# Altium schematic sheet sheet reciver.schdoc
size 278 x 209 mm
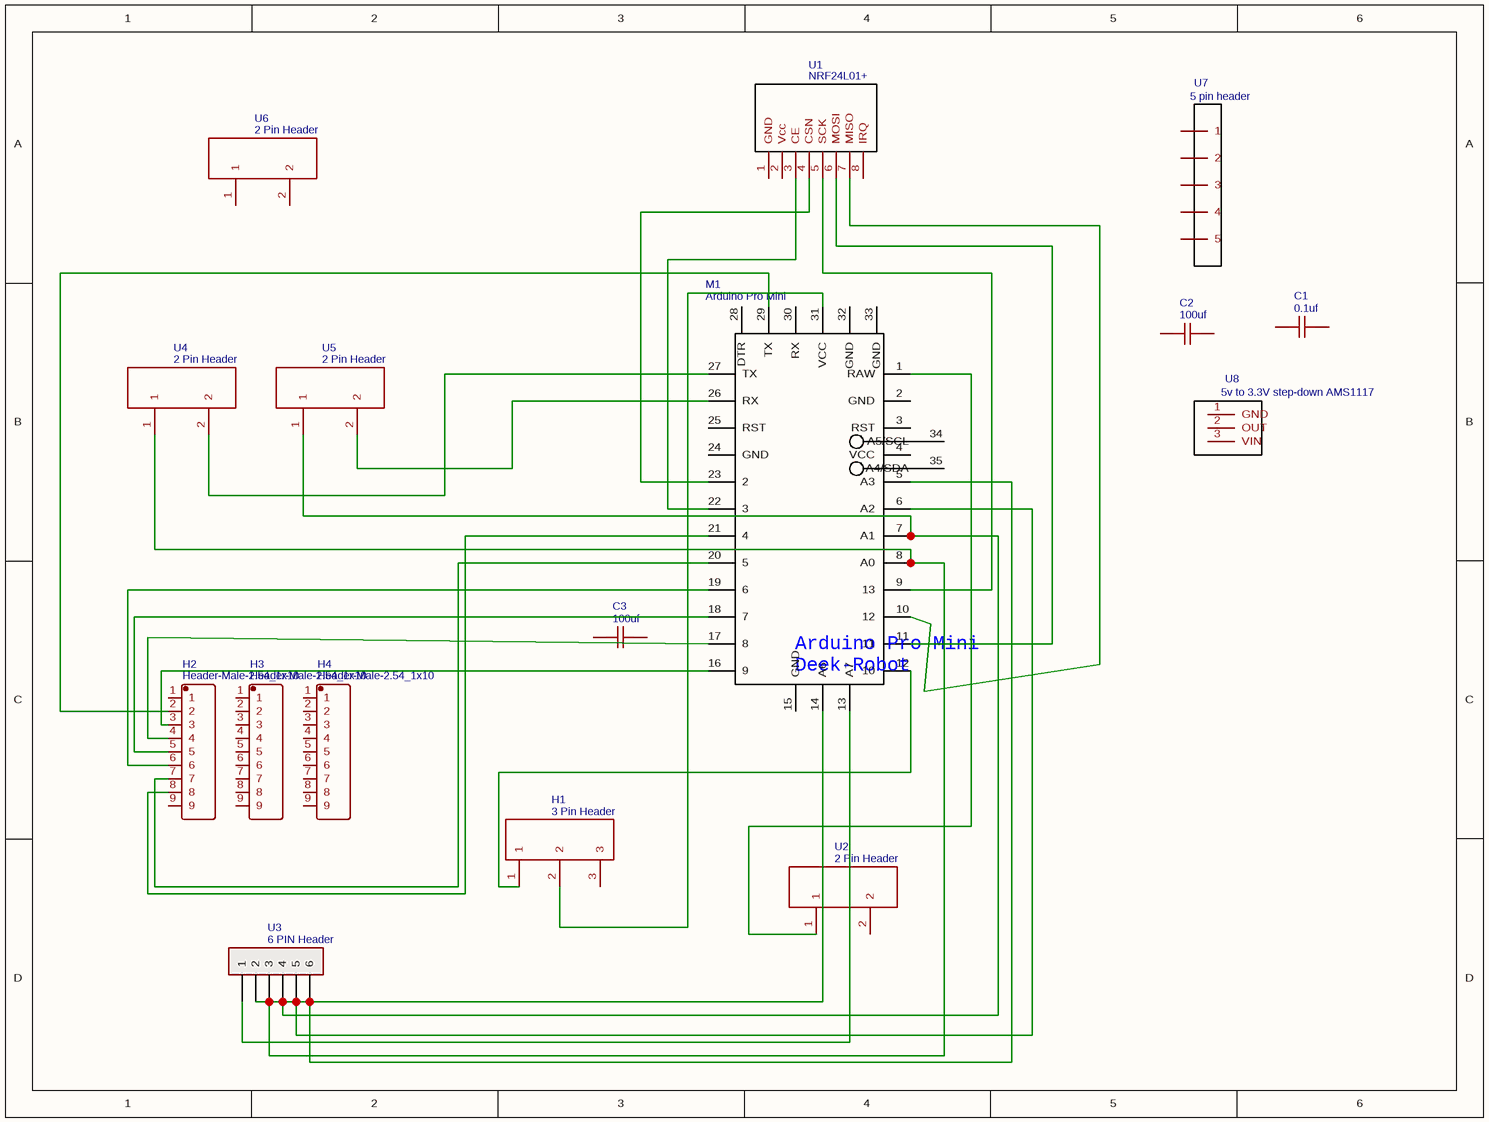
[diagram p0: sheet reciver.schdoc]

## Parts
C1  0.1uf  [C0603]
C2  100uf  [C0603]
C3  100uf  [C0603]
H1  3 Pin Header  [HEADER 3 PIN]
H2  Header-Male-2.54_1x10  [HDR-TH_10P-P2.54-V]
H3  Header-Male-2.54_1x10  [HDR-TH_10P-P2.54-V]
H4  Header-Male-2.54_1x10  [HDR-TH_10P-P2.54-V]
M1  Arduino Pro Mini  [ARDUINO PRO MINI]
U1  NRF24L01+  [NRF24L01+ PA LNA TAPDAF]
U2  2 Pin Header  [HEADER 2 PIN]
U3  6 PIN Header  [6_PIN_HEADER_MDG]
U4  2 Pin Header  [HEADER 2 PIN]
U5  2 Pin Header  [HEADER 2 PIN]
U6  2 Pin Header  [HEADER 2 PIN]
U7  5 pin header
U8  5v to 3.3V step-down AMS1117  [5V TO 3.3V STEP-DOWN VOLTAGE REGULATOR AMS1117]

## Nets
NetH1_1: H1.1 M1.12(10)
NetH1_2: H1.2 M1.31(VCC)
NetH2_2: H2.2 M1.29(TX)
NetH2_3: H2.3 M1.16(9)
NetH2_4: H2.4 M1.17(8)
NetH2_5: H2.5 M1.18(7)
NetH2_6: H2.6 M1.19(6)
NetH2_7: H2.7 M1.20(5)
NetH2_8: H2.8 M1.21(4)
NetM1_1: M1.1(RAW) U2.1
NetM1_5: M1.5(A3) M1.6(A2) M1.7(A1) M1.8(A0) M1.14(A6) U3.2 U3.3 U3.4 U3.5 U3.6 U4.1 U5.1
NetM1_9: M1.9(13) U1.5(SCK)
NetM1_10: M1.10(12) U1.7(MISO)
NetM1_11: M1.11 U1.6(MOSI)
NetM1_13: M1.13(A7) U3.1
NetM1_22: M1.22(3) U1.3(CE)
NetM1_23: M1.23(2) U1.4(CSN)
NetM1_26: M1.26(RX) U5.2
NetM1_27: M1.27(TX) U4.2

Not connected (* = marked no-connect by the designer): C1 1 2; C2 1 2; C3 1 2; H1 3; H2 1 9; H3 1 2 3 4 5 6 7 8 9; H4 1 2 3 4 5 6 7 8 9; M1 2(GND) 3(RST) 4(VCC) 15(GND) 24(GND) 25(RST) 28(DTR) 30(RX) 32(GND) 33(GND) 34(A5/SCL) 35(A4/SDA); U1 1(GND) 2(Vcc) 8(IRQ); U2 2; U6 1 2; U7 1 2 3 4 5; U8 1(GND) 2(OUT) 3(VIN)

## Notes on the sheet
- (in symbol Arduino Pro Mini) Arduino Pro Mini / Deek-Robot

## Library data of the parts
C1 = 0.1uf: nameAlias: Value(F); Contributor: LCEDA_Lib; spicePre: C; spiceSymbolName: C_0603_US
C2 C3 = 100uf: nameAlias: Value(F); Contributor: LCEDA_Lib; spicePre: C; spiceSymbolName: C_0603_US
H1 = 3 Pin Header: Contributor: 18635746; spicePre: H; spiceSymbolName: 3 Pin Header
H2-H4 = Header-Male-2.54_1x10: BOM_Manufacturer Part: Headers  Pins2.54mm1*9p 9 pins; Contributor: 1rahul.thakur; BOM_Supplier: LCSC; image: http://image.lceda.cn/szlcsc/C57369.jpg; BOM_Supplier Part: C57369; spicePre: H; spiceSymbolName: Header-Male-2.54_1x10
M1 = Arduino Pro Mini: Contributor: albertal; BOM_Manufacturer Part: Arduino Pro Mini; spicePre: M; spiceSymbolName: Arduino Pro Mini
U1 = NRF24L01+: Contributor: Sinuhe Pardo; BOM_Manufacturer Part: NRF24L01+; spicePre: U; spiceSymbolName: NRF24L01+
U2 U4-U6 = 2 Pin Header: Contributor: 18635746; spicePre: U; spiceSymbolName: 2 Pin Header
U3 = 6 PIN Header: BOM_Manufacturer Part: New SchematicLib; Contributor: Bartosz Koziel; spicePre: U; spiceSymbolName: 6 PIN Header
U7 = 5 pin header: Contributor: alberto.perez.madruga; spicePre: U; spiceSymbolName: 5 pin header
U8 = 5v to 3.3V step-down AMS1117: Contributor: winter2015; sourceId: YsmgyP7pj; timeStamp: 1455540653; spicePre: U; spiceSymbolName: 5v to 3.3V step-down AMS1117